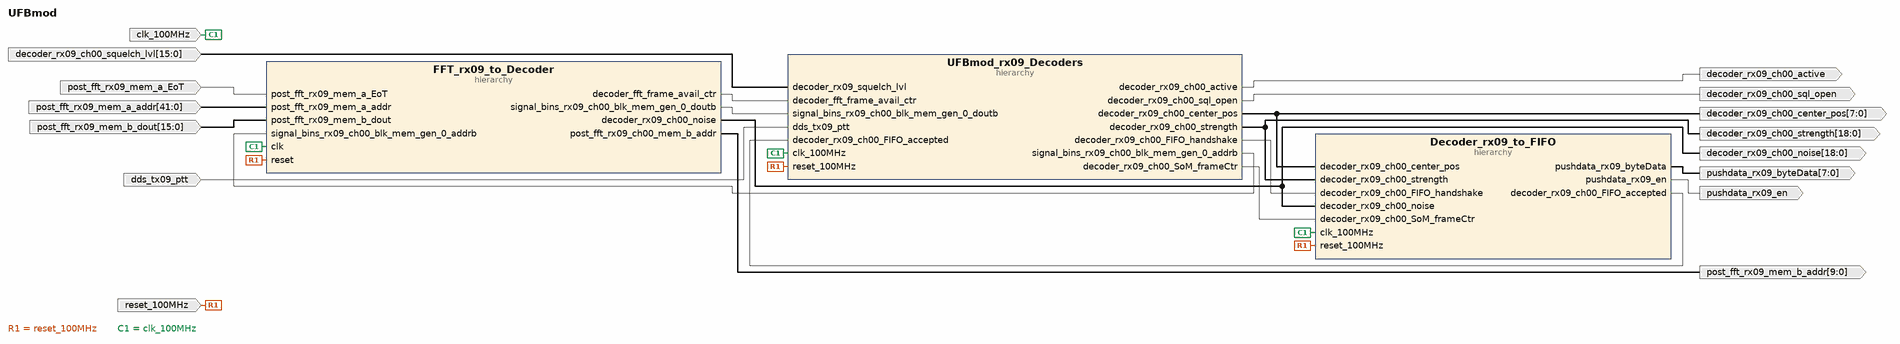
[diagram p0: block diagram of the top level]
# Vivado block design UFBmod, xc7a100tfgg484-2, Vivado 2020.1.1
create_bd_design UFBmod

create_bd_port -dir I -type rst reset_100MHz
set_property -dict {CONFIG.POLARITY ACTIVE_HIGH} [get_bd_ports reset_100MHz]
create_bd_port -dir I -type clk clk_100MHz
set_property -dict {CONFIG.ASSOCIATED_RESET reset_100MHz CONFIG.FREQ_HZ 100000000} [get_bd_ports clk_100MHz]
create_bd_port -dir I post_fft_rx09_mem_a_EoT
create_bd_port -dir I -from 41 -to 0 post_fft_rx09_mem_a_addr
create_bd_port -dir I -from 15 -to 0 -type data post_fft_rx09_mem_b_dout
create_bd_port -dir O -from 9 -to 0 post_fft_rx09_mem_b_addr
create_bd_port -dir I -from 15 -to 0 -type data decoder_rx09_ch00_squelch_lvl
create_bd_port -dir O pushdata_rx09_en
create_bd_port -dir O -from 7 -to 0 -type data pushdata_rx09_byteData
create_bd_port -dir I dds_tx09_ptt
create_bd_port -dir O decoder_rx09_ch00_sql_open
create_bd_port -dir O decoder_rx09_ch00_active
create_bd_port -dir O -from 7 -to 0 decoder_rx09_ch00_center_pos
create_bd_port -dir O -from 18 -to 0 decoder_rx09_ch00_noise
create_bd_port -dir O -from 18 -to 0 decoder_rx09_ch00_strength

create_bd_cell -type hier FFT_rx09_to_Decoder
create_bd_cell -type hier UFBmod_rx09_Decoders
create_bd_cell -type hier Decoder_rx09_to_FIFO

# ---- hierarchy /FFT_rx09_to_Decoder ----
current_bd_instance /FFT_rx09_to_Decoder
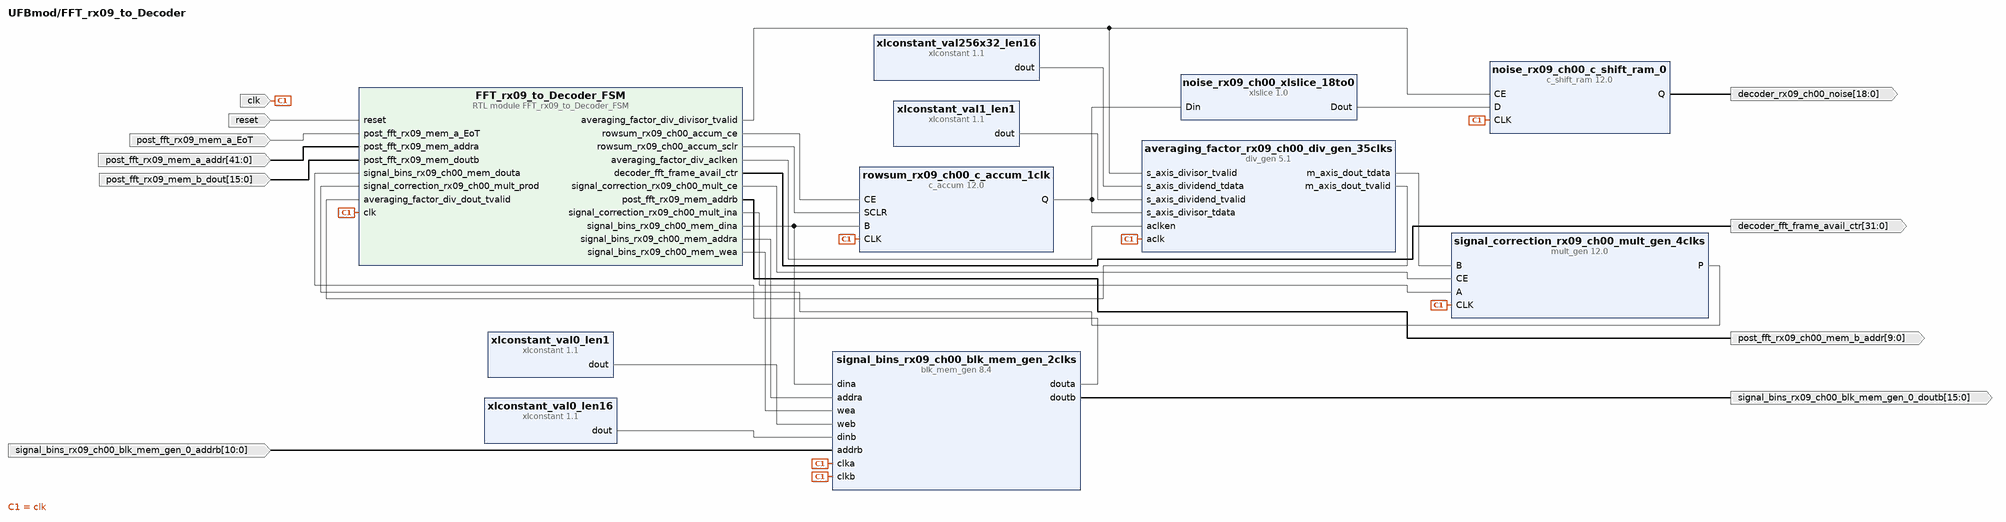
[diagram p1: block diagram inside /FFT_rx09_to_Decoder]
create_bd_pin -dir I -type clk clk
create_bd_pin -dir I -type rst reset
create_bd_pin -dir I post_fft_rx09_mem_a_EoT
create_bd_pin -dir I -from 41 -to 0 post_fft_rx09_mem_a_addr
create_bd_pin -dir O -from 9 -to 0 post_fft_rx09_ch00_mem_b_addr
create_bd_pin -dir I -from 15 -to 0 -type data post_fft_rx09_mem_b_dout
create_bd_pin -dir O -from 31 -to 0 decoder_fft_frame_avail_ctr
create_bd_pin -dir O -from 15 -to 0 signal_bins_rx09_ch00_blk_mem_gen_0_doutb
create_bd_pin -dir I -from 10 -to 0 signal_bins_rx09_ch00_blk_mem_gen_0_addrb
create_bd_pin -dir O -from 18 -to 0 decoder_rx09_ch00_noise

create_bd_cell -type ip -vlnv xilinx.com:ip:blk_mem_gen:8.4 signal_bins_rx09_ch00_blk_mem_gen_2clks
set_property -dict [list \
  CONFIG.Assume_Synchronous_Clk true \
  CONFIG.Disable_Collision_Warnings true \
  CONFIG.Enable_32bit_Address false \
  CONFIG.Enable_A Always_Enabled \
  CONFIG.Enable_B Always_Enabled \
  CONFIG.Fill_Remaining_Memory_Locations true \
  CONFIG.Memory_Type True_Dual_Port_RAM \
  CONFIG.Operating_Mode_A NO_CHANGE \
  CONFIG.Operating_Mode_B NO_CHANGE \
  CONFIG.Port_B_Clock 100 \
  CONFIG.Port_B_Enable_Rate 100 \
  CONFIG.Port_B_Write_Rate 50 \
  CONFIG.Read_Width_A 16 \
  CONFIG.Read_Width_B 16 \
  CONFIG.Register_PortA_Output_of_Memory_Primitives true \
  CONFIG.Register_PortB_Output_of_Memory_Primitives true \
  CONFIG.Use_Byte_Write_Enable false \
  CONFIG.Use_RSTA_Pin false \
  CONFIG.Write_Depth_A 2048 \
  CONFIG.Write_Width_A 16 \
  CONFIG.Write_Width_B 16 \
  CONFIG.use_bram_block Stand_Alone \
] [get_bd_cells signal_bins_rx09_ch00_blk_mem_gen_2clks]
create_bd_cell -type ip -vlnv xilinx.com:ip:xlconstant:1.1 xlconstant_val1_len1
create_bd_cell -type ip -vlnv xilinx.com:ip:c_accum:12.0 rowsum_rx09_ch00_c_accum_1clk
set_property -dict [list \
  CONFIG.Bypass false \
  CONFIG.CE true \
  CONFIG.Implementation DSP48 \
  CONFIG.Input_Type Unsigned \
  CONFIG.Input_Width 16 \
  CONFIG.Output_Width 32 \
  CONFIG.SCLR true \
] [get_bd_cells rowsum_rx09_ch00_c_accum_1clk]
create_bd_cell -type ip -vlnv xilinx.com:ip:mult_gen:12.0 signal_correction_rx09_ch00_mult_gen_4clks
set_property -dict [list \
  CONFIG.ClockEnable true \
  CONFIG.Multiplier_Construction Use_Mults \
  CONFIG.OptGoal Speed \
  CONFIG.OutputWidthHigh 31 \
  CONFIG.OutputWidthLow 16 \
  CONFIG.PipeStages 4 \
  CONFIG.PortAType Unsigned \
  CONFIG.PortAWidth 16 \
  CONFIG.PortBType Unsigned \
  CONFIG.PortBWidth 32 \
  CONFIG.Use_Custom_Output_Width true \
] [get_bd_cells signal_correction_rx09_ch00_mult_gen_4clks]
create_bd_cell -type ip -vlnv xilinx.com:ip:div_gen:5.1 averaging_factor_rx09_ch00_div_gen_35clks
set_property -dict [list \
  CONFIG.ACLKEN true \
  CONFIG.FlowControl Blocking \
  CONFIG.OptimizeGoal Resources \
  CONFIG.algorithm_type Radix2 \
  CONFIG.clocks_per_division 1 \
  CONFIG.divide_by_zero_detect true \
  CONFIG.dividend_and_quotient_width 16 \
  CONFIG.divisor_width 32 \
  CONFIG.fractional_width 16 \
  CONFIG.latency 35 \
  CONFIG.latency_configuration Automatic \
  CONFIG.operand_sign Unsigned \
  CONFIG.remainder_type Fractional \
] [get_bd_cells averaging_factor_rx09_ch00_div_gen_35clks]
create_bd_cell -type ip -vlnv xilinx.com:ip:xlconstant:1.1 xlconstant_val256x32_len16
set_property -dict {CONFIG.CONST_VAL 8192 CONFIG.CONST_WIDTH 16} [get_bd_cells xlconstant_val256x32_len16]
create_bd_cell -type ip -vlnv xilinx.com:ip:xlconstant:1.1 xlconstant_val0_len1
set_property -dict {CONFIG.CONST_VAL 0} [get_bd_cells xlconstant_val0_len1]
create_bd_cell -type ip -vlnv xilinx.com:ip:xlconstant:1.1 xlconstant_val0_len16
set_property -dict {CONFIG.CONST_WIDTH 16} [get_bd_cells xlconstant_val0_len16]
create_bd_cell -type ip -vlnv xilinx.com:ip:xlslice:1.0 noise_rx09_ch00_xlslice_18to0
set_property -dict {CONFIG.DIN_FROM 18 CONFIG.DOUT_WIDTH 19} [get_bd_cells noise_rx09_ch00_xlslice_18to0]
create_bd_cell -type ip -vlnv xilinx.com:ip:c_shift_ram:12.0 noise_rx09_ch00_c_shift_ram_0
set_property -dict [list \
  CONFIG.AsyncInitVal 0000000000000000000 \
  CONFIG.CE true \
  CONFIG.DefaultData 0000000000000000000 \
  CONFIG.Depth 1 \
  CONFIG.Width 19 \
] [get_bd_cells noise_rx09_ch00_c_shift_ram_0]
create_bd_cell -type module -reference FFT_rx09_to_Decoder_FSM FFT_rx09_to_Decoder_FSM

# ---- hierarchy /UFBmod_rx09_Decoders ----
current_bd_instance /UFBmod_rx09_Decoders
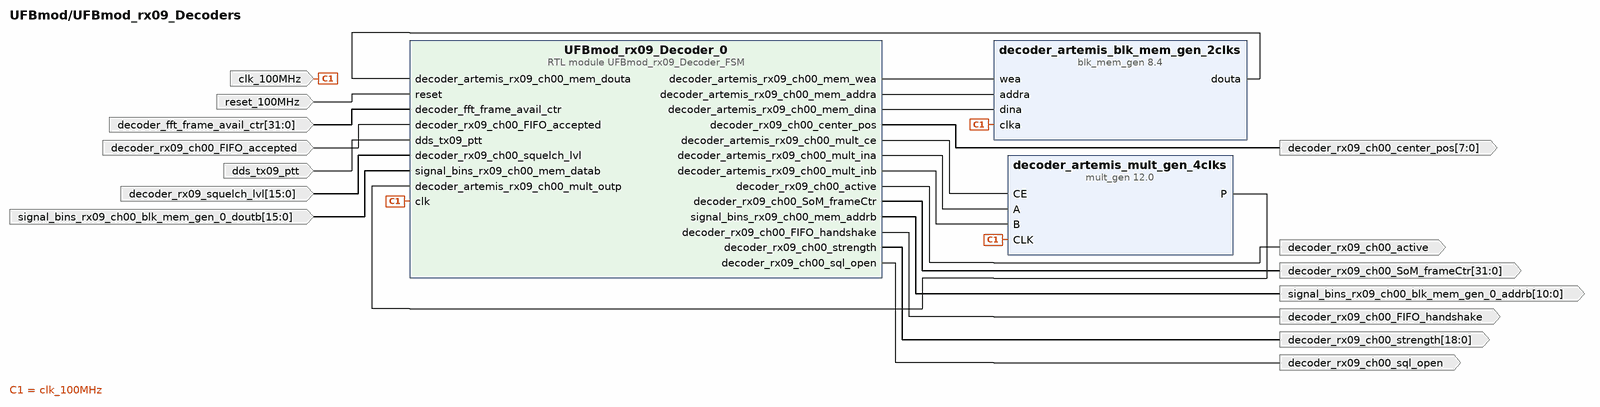
[diagram p2: block diagram inside /UFBmod_rx09_Decoders]
create_bd_pin -dir I -type rst reset_100MHz
create_bd_pin -dir I -type clk clk_100MHz
create_bd_pin -dir I -from 31 -to 0 decoder_fft_frame_avail_ctr
create_bd_pin -dir I -from 15 -to 0 signal_bins_rx09_ch00_blk_mem_gen_0_doutb
create_bd_pin -dir O -from 10 -to 0 signal_bins_rx09_ch00_blk_mem_gen_0_addrb
create_bd_pin -dir I -from 15 -to 0 decoder_rx09_squelch_lvl
create_bd_pin -dir I decoder_rx09_ch00_FIFO_accepted
create_bd_pin -dir O decoder_rx09_ch00_FIFO_handshake
create_bd_pin -dir O -from 7 -to 0 decoder_rx09_ch00_center_pos
create_bd_pin -dir O -from 18 -to 0 decoder_rx09_ch00_strength
create_bd_pin -dir O -from 31 -to 0 decoder_rx09_ch00_SoM_frameCtr
create_bd_pin -dir I dds_tx09_ptt
create_bd_pin -dir O decoder_rx09_ch00_sql_open
create_bd_pin -dir O decoder_rx09_ch00_active

create_bd_cell -type ip -vlnv xilinx.com:ip:blk_mem_gen:8.4 decoder_artemis_blk_mem_gen_2clks
set_property -dict [list \
  CONFIG.Algorithm Minimum_Area \
  CONFIG.Enable_32bit_Address false \
  CONFIG.Enable_A Always_Enabled \
  CONFIG.Fill_Remaining_Memory_Locations true \
  CONFIG.Operating_Mode_A NO_CHANGE \
  CONFIG.Read_Width_A 16 \
  CONFIG.Register_PortA_Output_of_Memory_Primitives true \
  CONFIG.Use_Byte_Write_Enable false \
  CONFIG.Use_RSTA_Pin false \
  CONFIG.Write_Depth_A 128 \
  CONFIG.Write_Width_A 16 \
  CONFIG.use_bram_block Stand_Alone \
] [get_bd_cells decoder_artemis_blk_mem_gen_2clks]
create_bd_cell -type ip -vlnv xilinx.com:ip:mult_gen:12.0 decoder_artemis_mult_gen_4clks
set_property -dict [list \
  CONFIG.ClockEnable true \
  CONFIG.Multiplier_Construction Use_Mults \
  CONFIG.OutputWidthHigh 39 \
  CONFIG.OutputWidthLow 8 \
  CONFIG.PortAType Unsigned \
  CONFIG.PortAWidth 16 \
  CONFIG.PortBType Unsigned \
  CONFIG.PortBWidth 32 \
  CONFIG.Use_Custom_Output_Width true \
] [get_bd_cells decoder_artemis_mult_gen_4clks]
create_bd_cell -type module -reference UFBmod_rx09_Decoder_FSM UFBmod_rx09_Decoder_0

# ---- hierarchy /Decoder_rx09_to_FIFO ----
current_bd_instance /Decoder_rx09_to_FIFO
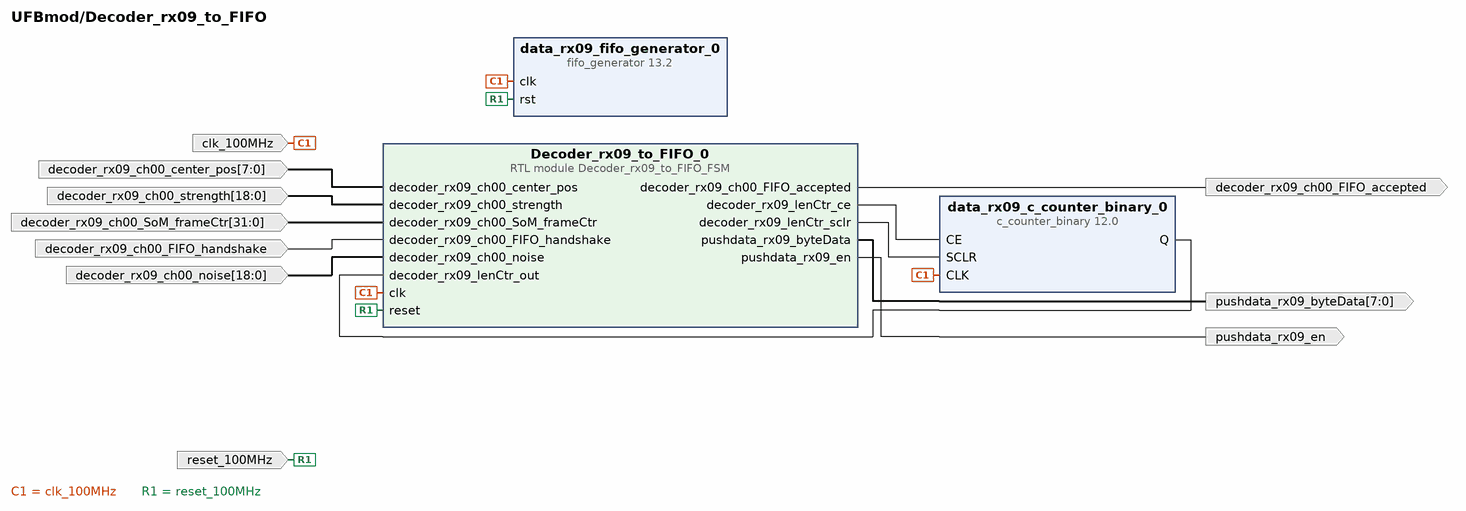
[diagram p3: block diagram inside /Decoder_rx09_to_FIFO]
create_bd_pin -dir I -type clk clk_100MHz
create_bd_pin -dir I -type rst reset_100MHz
create_bd_pin -dir O -from 7 -to 0 pushdata_rx09_byteData
create_bd_pin -dir O pushdata_rx09_en
create_bd_pin -dir O decoder_rx09_ch00_FIFO_accepted
create_bd_pin -dir I decoder_rx09_ch00_FIFO_handshake
create_bd_pin -dir I -from 7 -to 0 decoder_rx09_ch00_center_pos
create_bd_pin -dir I -from 18 -to 0 decoder_rx09_ch00_strength
create_bd_pin -dir I -from 31 -to 0 decoder_rx09_ch00_SoM_frameCtr
create_bd_pin -dir I -from 18 -to 0 decoder_rx09_ch00_noise

create_bd_cell -type ip -vlnv xilinx.com:ip:c_counter_binary:12.0 data_rx09_c_counter_binary_0
set_property -dict [list \
  CONFIG.CE true \
  CONFIG.Fb_Latency_Configuration Automatic \
  CONFIG.Implementation DSP48 \
  CONFIG.Latency_Configuration Automatic \
  CONFIG.Load false \
  CONFIG.Output_Width 10 \
  CONFIG.SCLR true \
] [get_bd_cells data_rx09_c_counter_binary_0]
create_bd_cell -type ip -vlnv xilinx.com:ip:fifo_generator:13.2 data_rx09_fifo_generator_0
set_property -dict [list \
  CONFIG.Enable_Safety_Circuit true \
  CONFIG.Fifo_Implementation Common_Clock_Block_RAM \
  CONFIG.Full_Flags_Reset_Value 0 \
  CONFIG.Input_Data_Width 1 \
  CONFIG.Output_Data_Width 8 \
  CONFIG.Reset_Type Asynchronous_Reset \
  CONFIG.Use_Dout_Reset true \
  CONFIG.Use_Embedded_Registers true \
] [get_bd_cells data_rx09_fifo_generator_0]
create_bd_cell -type module -reference Decoder_rx09_to_FIFO_FSM Decoder_rx09_to_FIFO_0

# ---- connections ----

current_bd_instance /FFT_rx09_to_Decoder
connect_bd_net -net clk_100MHz [get_bd_pins clk] \
  [get_bd_pins signal_bins_rx09_ch00_blk_mem_gen_2clks/clkb] [get_bd_pins signal_bins_rx09_ch00_blk_mem_gen_2clks/clka] \
  [get_bd_pins rowsum_rx09_ch00_c_accum_1clk/CLK] [get_bd_pins signal_correction_rx09_ch00_mult_gen_4clks/CLK] \
  [get_bd_pins averaging_factor_rx09_ch00_div_gen_35clks/aclk] [get_bd_pins noise_rx09_ch00_c_shift_ram_0/CLK] \
  [get_bd_pins FFT_rx09_to_Decoder_FSM/clk]
connect_bd_net -net signal_bins_rx09_ch00_blk_mem_gen_0_doutb [get_bd_pins signal_bins_rx09_ch00_blk_mem_gen_2clks/doutb] \
  [get_bd_pins signal_bins_rx09_ch00_blk_mem_gen_0_doutb]
connect_bd_net [get_bd_pins signal_bins_rx09_ch00_blk_mem_gen_0_addrb] [get_bd_pins signal_bins_rx09_ch00_blk_mem_gen_2clks/addrb]
connect_bd_net -net reset_100MHz [get_bd_pins reset] [get_bd_pins FFT_rx09_to_Decoder_FSM/reset]
connect_bd_net [get_bd_pins post_fft_rx09_mem_a_EoT] [get_bd_pins FFT_rx09_to_Decoder_FSM/post_fft_rx09_mem_a_EoT]
connect_bd_net [get_bd_pins post_fft_rx09_mem_a_addr] [get_bd_pins FFT_rx09_to_Decoder_FSM/post_fft_rx09_mem_addra]
connect_bd_net [get_bd_pins post_fft_rx09_mem_b_dout] [get_bd_pins FFT_rx09_to_Decoder_FSM/post_fft_rx09_mem_doutb]
connect_bd_net -net post_fft_rx09_ch00_mem_b_addr [get_bd_pins FFT_rx09_to_Decoder_FSM/post_fft_rx09_mem_addrb] \
  [get_bd_pins post_fft_rx09_ch00_mem_b_addr]
connect_bd_net -net decoder_fft_frame_avail_ctr [get_bd_pins FFT_rx09_to_Decoder_FSM/decoder_fft_frame_avail_ctr] \
  [get_bd_pins decoder_fft_frame_avail_ctr]
connect_bd_net -net signal_bins_rx09_ch00_blk_mem_gen_0_dina [get_bd_pins FFT_rx09_to_Decoder_FSM/signal_bins_rx09_ch00_mem_dina] \
  [get_bd_pins rowsum_rx09_ch00_c_accum_1clk/B] [get_bd_pins signal_bins_rx09_ch00_blk_mem_gen_2clks/dina]
connect_bd_net -net rowsum_rx09_ch00_accum_ce [get_bd_pins FFT_rx09_to_Decoder_FSM/rowsum_rx09_ch00_accum_ce] \
  [get_bd_pins rowsum_rx09_ch00_c_accum_1clk/CE]
connect_bd_net -net rowsum_rx09_ch00_accum_sclr [get_bd_pins FFT_rx09_to_Decoder_FSM/rowsum_rx09_ch00_accum_sclr] \
  [get_bd_pins rowsum_rx09_ch00_c_accum_1clk/SCLR]
connect_bd_net -net averaging_factor_div_dout_tdata [get_bd_pins averaging_factor_rx09_ch00_div_gen_35clks/m_axis_dout_tdata] \
  [get_bd_pins signal_correction_rx09_ch00_mult_gen_4clks/B]
connect_bd_net -net averaging_factor_div_divisor_tdata [get_bd_pins rowsum_rx09_ch00_c_accum_1clk/Q] \
  [get_bd_pins averaging_factor_rx09_ch00_div_gen_35clks/s_axis_divisor_tdata] \
  [get_bd_pins noise_rx09_ch00_xlslice_18to0/Din]
connect_bd_net -net averaging_factor_div_dividend_tdata [get_bd_pins xlconstant_val256x32_len16/dout] \
  [get_bd_pins averaging_factor_rx09_ch00_div_gen_35clks/s_axis_dividend_tdata]
connect_bd_net -net averaging_factor_div_dividend_tvalid [get_bd_pins xlconstant_val1_len1/dout] \
  [get_bd_pins averaging_factor_rx09_ch00_div_gen_35clks/s_axis_dividend_tvalid]
connect_bd_net -net averaging_factor_divider_aclken [get_bd_pins FFT_rx09_to_Decoder_FSM/averaging_factor_div_aclken] \
  [get_bd_pins averaging_factor_rx09_ch00_div_gen_35clks/aclken]
connect_bd_net -net signal_bins_rx09_ch00_blk_mem_gen_0_douta [get_bd_pins signal_bins_rx09_ch00_blk_mem_gen_2clks/douta] \
  [get_bd_pins FFT_rx09_to_Decoder_FSM/signal_bins_rx09_ch00_mem_douta]
connect_bd_net -net signal_bins_rx09_ch00_blk_mem_gen_0_addra [get_bd_pins FFT_rx09_to_Decoder_FSM/signal_bins_rx09_ch00_mem_addra] \
  [get_bd_pins signal_bins_rx09_ch00_blk_mem_gen_2clks/addra]
connect_bd_net -net signal_bins_rx09_ch00_blk_mem_gen_0_wea [get_bd_pins FFT_rx09_to_Decoder_FSM/signal_bins_rx09_ch00_mem_wea] \
  [get_bd_pins signal_bins_rx09_ch00_blk_mem_gen_2clks/wea]
connect_bd_net [get_bd_pins xlconstant_val0_len1/dout] [get_bd_pins signal_bins_rx09_ch00_blk_mem_gen_2clks/web]
connect_bd_net [get_bd_pins xlconstant_val0_len16/dout] [get_bd_pins signal_bins_rx09_ch00_blk_mem_gen_2clks/dinb]
connect_bd_net -net signal_correction_rx09_ch00_mult_prod [get_bd_pins signal_correction_rx09_ch00_mult_gen_4clks/P] \
  [get_bd_pins FFT_rx09_to_Decoder_FSM/signal_correction_rx09_ch00_mult_prod]
connect_bd_net -net averaging_factor_div_dout_tvalid [get_bd_pins averaging_factor_rx09_ch00_div_gen_35clks/m_axis_dout_tvalid] \
  [get_bd_pins FFT_rx09_to_Decoder_FSM/averaging_factor_div_dout_tvalid]
connect_bd_net -net averaging_factor_div_divisor_tvalid [get_bd_pins FFT_rx09_to_Decoder_FSM/averaging_factor_div_divisor_tvalid] \
  [get_bd_pins averaging_factor_rx09_ch00_div_gen_35clks/s_axis_divisor_tvalid] \
  [get_bd_pins noise_rx09_ch00_c_shift_ram_0/CE]
connect_bd_net -net signal_correction_rx09_ch00_mult_ce [get_bd_pins FFT_rx09_to_Decoder_FSM/signal_correction_rx09_ch00_mult_ce] \
  [get_bd_pins signal_correction_rx09_ch00_mult_gen_4clks/CE]
connect_bd_net [get_bd_pins FFT_rx09_to_Decoder_FSM/signal_correction_rx09_ch00_mult_ina] [get_bd_pins signal_correction_rx09_ch00_mult_gen_4clks/A]
connect_bd_net [get_bd_pins noise_rx09_ch00_xlslice_18to0/Dout] [get_bd_pins noise_rx09_ch00_c_shift_ram_0/D]
connect_bd_net [get_bd_pins noise_rx09_ch00_c_shift_ram_0/Q] [get_bd_pins decoder_rx09_ch00_noise]

current_bd_instance /UFBmod_rx09_Decoders
connect_bd_net [get_bd_pins reset_100MHz] [get_bd_pins UFBmod_rx09_Decoder_0/reset]
connect_bd_net [get_bd_pins clk_100MHz] \
  [get_bd_pins decoder_artemis_blk_mem_gen_2clks/clka] [get_bd_pins decoder_artemis_mult_gen_4clks/CLK] \
  [get_bd_pins UFBmod_rx09_Decoder_0/clk]
connect_bd_net [get_bd_pins decoder_fft_frame_avail_ctr] [get_bd_pins UFBmod_rx09_Decoder_0/decoder_fft_frame_avail_ctr]
connect_bd_net [get_bd_pins decoder_rx09_ch00_FIFO_accepted] [get_bd_pins UFBmod_rx09_Decoder_0/decoder_rx09_ch00_FIFO_accepted]
connect_bd_net [get_bd_pins dds_tx09_ptt] [get_bd_pins UFBmod_rx09_Decoder_0/dds_tx09_ptt]
connect_bd_net -net signal_bins_rx09_ch00_blk_mem_gen_0_addrb [get_bd_pins UFBmod_rx09_Decoder_0/signal_bins_rx09_ch00_mem_addrb] \
  [get_bd_pins signal_bins_rx09_ch00_blk_mem_gen_0_addrb]
connect_bd_net -net decoder_rx09_ch00_center_pos [get_bd_pins UFBmod_rx09_Decoder_0/decoder_rx09_ch00_center_pos] \
  [get_bd_pins decoder_rx09_ch00_center_pos]
connect_bd_net -net decoder_rx09_ch00_strength [get_bd_pins UFBmod_rx09_Decoder_0/decoder_rx09_ch00_strength] [get_bd_pins decoder_rx09_ch00_strength]
connect_bd_net -net decoder_rx09_ch00_SoM_frameCtr [get_bd_pins UFBmod_rx09_Decoder_0/decoder_rx09_ch00_SoM_frameCtr] \
  [get_bd_pins decoder_rx09_ch00_SoM_frameCtr]
connect_bd_net -net decoder_rx09_ch00_sql_open [get_bd_pins UFBmod_rx09_Decoder_0/decoder_rx09_ch00_sql_open] [get_bd_pins decoder_rx09_ch00_sql_open]
connect_bd_net -net decoder_rx09_ch00_active [get_bd_pins UFBmod_rx09_Decoder_0/decoder_rx09_ch00_active] [get_bd_pins decoder_rx09_ch00_active]
connect_bd_net -net decoder_rx09_ch00_FIFO_handshake [get_bd_pins UFBmod_rx09_Decoder_0/decoder_rx09_ch00_FIFO_handshake] \
  [get_bd_pins decoder_rx09_ch00_FIFO_handshake]
connect_bd_net [get_bd_pins decoder_rx09_squelch_lvl] [get_bd_pins UFBmod_rx09_Decoder_0/decoder_rx09_ch00_squelch_lvl]
connect_bd_net [get_bd_pins signal_bins_rx09_ch00_blk_mem_gen_0_doutb] [get_bd_pins UFBmod_rx09_Decoder_0/signal_bins_rx09_ch00_mem_datab]
connect_bd_net -net decoder_artemis_blk_mem_gen_0_douta [get_bd_pins decoder_artemis_blk_mem_gen_2clks/douta] \
  [get_bd_pins UFBmod_rx09_Decoder_0/decoder_artemis_rx09_ch00_mem_douta]
connect_bd_net [get_bd_pins UFBmod_rx09_Decoder_0/decoder_artemis_rx09_ch00_mem_wea] [get_bd_pins decoder_artemis_blk_mem_gen_2clks/wea]
connect_bd_net [get_bd_pins UFBmod_rx09_Decoder_0/decoder_artemis_rx09_ch00_mem_addra] [get_bd_pins decoder_artemis_blk_mem_gen_2clks/addra]
connect_bd_net [get_bd_pins UFBmod_rx09_Decoder_0/decoder_artemis_rx09_ch00_mem_dina] [get_bd_pins decoder_artemis_blk_mem_gen_2clks/dina]
connect_bd_net [get_bd_pins decoder_artemis_mult_gen_4clks/P] [get_bd_pins UFBmod_rx09_Decoder_0/decoder_artemis_rx09_ch00_mult_outp]
connect_bd_net [get_bd_pins UFBmod_rx09_Decoder_0/decoder_artemis_rx09_ch00_mult_ce] [get_bd_pins decoder_artemis_mult_gen_4clks/CE]
connect_bd_net [get_bd_pins UFBmod_rx09_Decoder_0/decoder_artemis_rx09_ch00_mult_ina] [get_bd_pins decoder_artemis_mult_gen_4clks/A]
connect_bd_net [get_bd_pins UFBmod_rx09_Decoder_0/decoder_artemis_rx09_ch00_mult_inb] [get_bd_pins decoder_artemis_mult_gen_4clks/B]

current_bd_instance /Decoder_rx09_to_FIFO
connect_bd_net [get_bd_pins clk_100MHz] \
  [get_bd_pins data_rx09_fifo_generator_0/clk] [get_bd_pins data_rx09_c_counter_binary_0/CLK] \
  [get_bd_pins Decoder_rx09_to_FIFO_0/clk]
connect_bd_net [get_bd_pins reset_100MHz] [get_bd_pins data_rx09_fifo_generator_0/rst] [get_bd_pins Decoder_rx09_to_FIFO_0/reset]
connect_bd_net [get_bd_pins decoder_rx09_ch00_center_pos] [get_bd_pins Decoder_rx09_to_FIFO_0/decoder_rx09_ch00_center_pos]
connect_bd_net [get_bd_pins decoder_rx09_ch00_strength] [get_bd_pins Decoder_rx09_to_FIFO_0/decoder_rx09_ch00_strength]
connect_bd_net [get_bd_pins decoder_rx09_ch00_SoM_frameCtr] [get_bd_pins Decoder_rx09_to_FIFO_0/decoder_rx09_ch00_SoM_frameCtr]
connect_bd_net [get_bd_pins decoder_rx09_ch00_FIFO_handshake] [get_bd_pins Decoder_rx09_to_FIFO_0/decoder_rx09_ch00_FIFO_handshake]
connect_bd_net [get_bd_pins data_rx09_c_counter_binary_0/Q] [get_bd_pins Decoder_rx09_to_FIFO_0/decoder_rx09_lenCtr_out]
connect_bd_net [get_bd_pins Decoder_rx09_to_FIFO_0/decoder_rx09_ch00_FIFO_accepted] [get_bd_pins decoder_rx09_ch00_FIFO_accepted]
connect_bd_net [get_bd_pins Decoder_rx09_to_FIFO_0/pushdata_rx09_en] [get_bd_pins pushdata_rx09_en]
connect_bd_net [get_bd_pins Decoder_rx09_to_FIFO_0/pushdata_rx09_byteData] [get_bd_pins pushdata_rx09_byteData]
connect_bd_net [get_bd_pins Decoder_rx09_to_FIFO_0/decoder_rx09_lenCtr_ce] [get_bd_pins data_rx09_c_counter_binary_0/CE]
connect_bd_net [get_bd_pins Decoder_rx09_to_FIFO_0/decoder_rx09_lenCtr_sclr] [get_bd_pins data_rx09_c_counter_binary_0/SCLR]
connect_bd_net [get_bd_pins decoder_rx09_ch00_noise] [get_bd_pins Decoder_rx09_to_FIFO_0/decoder_rx09_ch00_noise]

current_bd_instance /
connect_bd_net [get_bd_ports reset_100MHz] \
  [get_bd_pins FFT_rx09_to_Decoder/reset] [get_bd_pins Decoder_rx09_to_FIFO/reset_100MHz] \
  [get_bd_pins UFBmod_rx09_Decoders/reset_100MHz]
connect_bd_net [get_bd_ports clk_100MHz] \
  [get_bd_pins FFT_rx09_to_Decoder/clk] [get_bd_pins Decoder_rx09_to_FIFO/clk_100MHz] \
  [get_bd_pins UFBmod_rx09_Decoders/clk_100MHz]
connect_bd_net [get_bd_ports post_fft_rx09_mem_a_EoT] [get_bd_pins FFT_rx09_to_Decoder/post_fft_rx09_mem_a_EoT]
connect_bd_net [get_bd_ports post_fft_rx09_mem_a_addr] [get_bd_pins FFT_rx09_to_Decoder/post_fft_rx09_mem_a_addr]
connect_bd_net [get_bd_ports post_fft_rx09_mem_b_dout] [get_bd_pins FFT_rx09_to_Decoder/post_fft_rx09_mem_b_dout]
connect_bd_net -net post_fft_rx09_ch00_mem_b_addr [get_bd_pins FFT_rx09_to_Decoder/post_fft_rx09_ch00_mem_b_addr] \
  [get_bd_ports post_fft_rx09_mem_b_addr]
connect_bd_net -net decoder_fft_frame_avail_ctr [get_bd_pins FFT_rx09_to_Decoder/decoder_fft_frame_avail_ctr] \
  [get_bd_pins UFBmod_rx09_Decoders/decoder_fft_frame_avail_ctr]
connect_bd_net -net signal_bins_rx09_ch00_blk_mem_gen_0_doutb [get_bd_pins FFT_rx09_to_Decoder/signal_bins_rx09_ch00_blk_mem_gen_0_doutb] \
  [get_bd_pins UFBmod_rx09_Decoders/signal_bins_rx09_ch00_blk_mem_gen_0_doutb]
connect_bd_net -net signal_bins_rx09_ch00_blk_mem_gen_0_addrb [get_bd_pins UFBmod_rx09_Decoders/signal_bins_rx09_ch00_blk_mem_gen_0_addrb] \
  [get_bd_pins FFT_rx09_to_Decoder/signal_bins_rx09_ch00_blk_mem_gen_0_addrb]
connect_bd_net [get_bd_ports decoder_rx09_ch00_squelch_lvl] [get_bd_pins UFBmod_rx09_Decoders/decoder_rx09_squelch_lvl]
connect_bd_net -net pushdata_rx09_byteData [get_bd_pins Decoder_rx09_to_FIFO/pushdata_rx09_byteData] [get_bd_ports pushdata_rx09_byteData]
connect_bd_net -net pushdata_rx09_en [get_bd_pins Decoder_rx09_to_FIFO/pushdata_rx09_en] [get_bd_ports pushdata_rx09_en]
connect_bd_net -net decoder_rx09_ch00_FIFO_accepted [get_bd_pins Decoder_rx09_to_FIFO/decoder_rx09_ch00_FIFO_accepted] \
  [get_bd_pins UFBmod_rx09_Decoders/decoder_rx09_ch00_FIFO_accepted]
connect_bd_net -net decoder_rx09_ch00_FIFO_handshake [get_bd_pins UFBmod_rx09_Decoders/decoder_rx09_ch00_FIFO_handshake] \
  [get_bd_pins Decoder_rx09_to_FIFO/decoder_rx09_ch00_FIFO_handshake]
connect_bd_net -net decoder_rx09_ch00_center_pos [get_bd_pins UFBmod_rx09_Decoders/decoder_rx09_ch00_center_pos] \
  [get_bd_pins Decoder_rx09_to_FIFO/decoder_rx09_ch00_center_pos] [get_bd_ports decoder_rx09_ch00_center_pos]
connect_bd_net -net decoder_rx09_ch00_strength [get_bd_pins UFBmod_rx09_Decoders/decoder_rx09_ch00_strength] \
  [get_bd_pins Decoder_rx09_to_FIFO/decoder_rx09_ch00_strength] [get_bd_ports decoder_rx09_ch00_strength]
connect_bd_net -net decoder_rx09_ch00_SoM_frameCtr [get_bd_pins UFBmod_rx09_Decoders/decoder_rx09_ch00_SoM_frameCtr] \
  [get_bd_pins Decoder_rx09_to_FIFO/decoder_rx09_ch00_SoM_frameCtr]
connect_bd_net [get_bd_ports dds_tx09_ptt] [get_bd_pins UFBmod_rx09_Decoders/dds_tx09_ptt]
connect_bd_net -net decoder_rx09_ch00_sql_open [get_bd_pins UFBmod_rx09_Decoders/decoder_rx09_ch00_sql_open] [get_bd_ports decoder_rx09_ch00_sql_open]
connect_bd_net -net decoder_rx09_ch00_active [get_bd_pins UFBmod_rx09_Decoders/decoder_rx09_ch00_active] [get_bd_ports decoder_rx09_ch00_active]
connect_bd_net [get_bd_pins FFT_rx09_to_Decoder/decoder_rx09_ch00_noise] \
  [get_bd_ports decoder_rx09_ch00_noise] [get_bd_pins Decoder_rx09_to_FIFO/decoder_rx09_ch00_noise]

validate_bd_design
save_bd_design
